# Altium schematic sheet 02-ESP32.SchDoc: *ESP32LX6
size A4; SheetNumber: 2; SheetTotal: 3
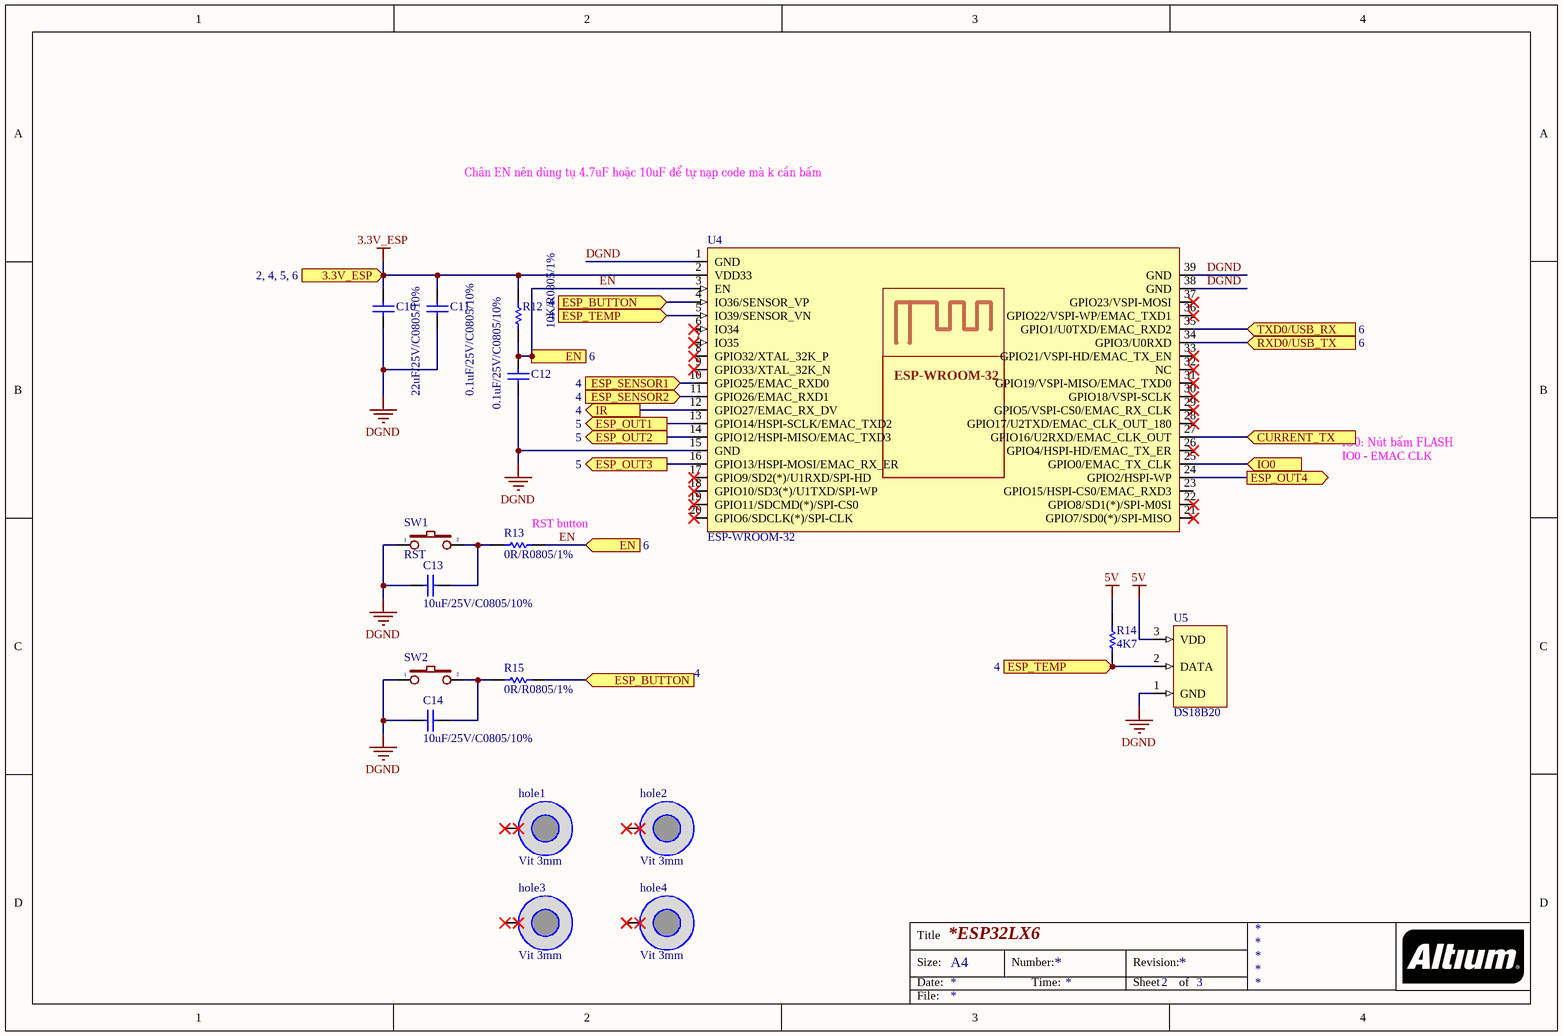
[diagram p0: 02-ESP32.SchDoc]

## Parts
C10  22uF/25V/C0805/10%  [CAP_CERA_C2012(CC0805INCH)]
C11  0.1uF/25V/C0805/10%  [CAP_CERA_C2012(CC0805INCH)]
C12  0.1uF/25V/C0805/10%  [CAP_CERA_C2012(CC0805INCH)]
C13  10uF/25V/C0805/10%  [CAP_CERA_C2012(CC0805INCH)]
C14  10uF/25V/C0805/10%  [CAP_CERA_C2012(CC0805INCH)]
hole1  Vit 3mm  [Screw 3.0]
hole2  Vit 3mm  [Screw 3.0]
hole3  Vit 3mm  [Screw 3.0]
hole4  Vit 3mm  [Screw 3.0]
R12  10K/R0805/1%  [Res 0805 SMD]
R13  0R/R0805/1%  [Res 0805 SMD]
R14  4K7  [Res 0805 SMD]
R15  0R/R0805/1%  [Res 0805 SMD]
SW1  RST  [Button 3x4mm]
SW2  RST  [Button 3x4mm]  (value not drawn)
U4  ESP-WROOM-32  [ESP32 WROOM]
U5  DS18B20

## Ports
3.3V_ESP (in, see 2, 4, 5, 6), CURRENT_TX (in), EN (in, see 6), ESP_BUTTON (in, see 4), ESP_OUT1 (out, see 5), ESP_OUT2 (out, see 5), ESP_OUT3 (out, see 5), ESP_OUT4 (out), ESP_SENSOR1 (in, see 4), ESP_SENSOR2 (in, see 4), ESP_TEMP (in, see 4), IO0 (in), IR (out, see 4), RXD0/USB_TX (in, see 6), TXD0/USB_RX (in, see 6)

## Nets
3.3V_ESP: C10.2 C11.2 R12.1 U4.2(VDD33) ; port 3.3V_ESP
5V: R14.2 U5.3(VDD)
DGND: C10.1 C11.1 C12.1 C13.2 C14.2 SW1.1 SW2.1 U4.1(GND) U4.15(GND) U4.38(GND) U4.39(GND) U5.1(GND)
CURRENT_TX: U4.27(GPIO16/U2RXD/EMAC_CLK_OUT) ; port CURRENT_TX
EN: C12.2 R12.2 R13.2 U4.3(EN) ; port EN
ESP_BUTTON: R15.2 U4.4(IO36/SENSOR_VP) ; port ESP_BUTTON
ESP_OUT1: U4.13(GPIO14/HSPI-SCLK/EMAC_TXD2) ; port ESP_OUT1
ESP_OUT2: U4.14(GPIO12/HSPI-MISO/EMAC_TXD3) ; port ESP_OUT2
ESP_OUT3: U4.16(GPIO13/HSPI-MOSI/EMAC_RX_ER) ; port ESP_OUT3
ESP_OUT4: U4.24(GPIO2/HSPI-WP) ; port ESP_OUT4
ESP_SENSOR1: U4.10(GPIO25/EMAC_RXD0) ; port ESP_SENSOR1
ESP_SENSOR2: U4.11(GPIO26/EMAC_RXD1) ; port ESP_SENSOR2
ESP_TEMP: R14.1 U4.5(IO39/SENSOR_VN) U5.2(DATA) ; port ESP_TEMP
IO0: U4.25(GPIO0/EMAC_TX_CLK) ; port IO0
IR: U4.12(GPIO27/EMAC_RX_DV) ; port IR
RXD0/USB_TX: U4.34(GPIO3/U0RXD) ; port RXD0/USB_TX
TXD0/USB_RX: U4.35(GPIO1/U0TXD/EMAC_RXD2) ; port TXD0/USB_RX
NetC13_1: C13.1 R13.1 SW1.2
NetC14_1: C14.1 R15.1 SW2.2

Not connected (* = marked no-connect by the designer): hole1 1(hole)*; hole2 1(hole)*; hole3 1(hole)*; hole4 1(hole)*; U4 6(IO34)* 7(IO35)* 8(GPIO32/XTAL_32K_P)* 9(GPIO33/XTAL_32K_N)* 17(GPIO9/SD2(*)/U1RXD/SPI-HD)* 18(GPIO10/SD3(*)/U1TXD/SPI-WP)* 19(GPIO11/SDCMD(*)/SPI-CS0)* 20(GPIO6/SDCLK(*)/SPI-CLK)* 21(GPIO7/SD0(*)/SPI-MISO)* 22(GPIO8/SD1(*)/SPI-M0SI)* 23(GPIO15/HSPI-CS0/EMAC_RXD3) 26(GPIO4/HSPI-HD/EMAC_TX_ER)* 28(GPIO17/U2TXD/EMAC_CLK_OUT_180)* 29(GPIO5/VSPI-CS0/EMAC_RX_CLK)* 30(GPIO18/VSPI-SCLK)* 31(GPIO19/VSPI-MISO/EMAC_TXD0)* 32(NC)* 33(GPIO21/VSPI-HD/EMAC_TX_EN)* 36(GPIO22/VSPI-WP/EMAC_TXD1)* 37(GPIO23/VSPI-MOSI)*

## Notes on the sheet
- Chân EN nên dùng tụ 4.7uF hoặc 10uF để tự nạp code mà k cần bấm
- IO0: Nút bấm FLASH
- IO0 - EMAC CLK
- (near R13) RST button
- Title
- Size:
- Date:
- A4
- Number:
- Time:
- Revision:
- Sheet
- of
- File:

## Library data of the parts
C10 = 0.1uF/50V/C0603/10%: 22µF ±20% 25V Ceramic Capacitor X5R 0805 (2012 Metric); Manufacturer: Tariff Applied; ComponentLink1URL: http://www.murata.com/~/media/webrenewal/support/library/catalog/products/capacitor/mlcc/c02e.ashx; ComponentLink1Description: http://www.murata.com/~/media/webrenewal/support/library/catalog/products/capacitor/mlcc/c02e.ashx; Digikey: 1276-2908-1-ND
C11-C14 = 0.1uF/50V/C0603/10%: 0.1µF ±10% 25V Ceramic Capacitor X7R 0805 (2012 Metric); ComponentLink1URL: http://www.murata.com/~/media/webrenewal/support/library/catalog/products/capacitor/mlcc/c02e.ashx; ComponentLink1Description: http://www.murata.com/~/media/webrenewal/support/library/catalog/products/capacitor/mlcc/c02e.ashx; Digikey: 478-3755-1-ND
R12 = 200K/R0603/1%: 10 kOhms ±1% 0.125W, 1/8W Chip Resistor 0805 (2012 Metric) Thick Film; Power (Watts): 0.1W, 1/10W; RoHS: RoHS Compliant; Category: Resistors; Part Status: Active; Features: Moisture Resistant; Operating Temperature: -55°C ~ 155°C; Package / Case: 0603 (1608 Metric); Supplier Device Package: 0603; Size / Dimension: 0.063" L x 0.031" W (1.60mm x 0.80mm); Height - Seated (Max): 0.022" (0.55mm); Failure Rate: -; ComponentLink1URL: http://www.yageo.com/documents/recent/PYu-RC_Group_51_RoHS_L_7.pdf; ComponentLink1Description: http://www.yageo.com/documents/recent/PYu-RC_Group_51_RoHS_L_7.pdf; Digikey: A126332CT-ND
R13 R15 = 200K/R0603/1%: 0 Ohms Jumper 0.125W, 1/8W Chip Resistor 0805 (2012 Metric) Automotive AEC-Q200 Thick Film; Part Status: Active; Height - Seated (Max): 0.022" (0.55mm); Failure Rate: -; ComponentLink1URL: http://www.yageo.com/documents/recent/PYu-RC_Group_51_RoHS_L_7.pdf; ComponentLink1Description: http://www.yageo.com/documents/recent/PYu-RC_Group_51_RoHS_L_7.pdf; Digikey: 541-0.0ACT-ND
R14 = 200K/R0603/1%: 4k7 Ohms Jumper 0.125W, 1/8W Chip Resistor 0805 (2012 Metric); Part Status: Active; Height - Seated (Max): 0.022" (0.55mm); Failure Rate: -; ComponentLink1URL: http://www.yageo.com/documents/recent/PYu-RC_Group_51_RoHS_L_7.pdf; ComponentLink1Description: http://www.yageo.com/documents/recent/PYu-RC_Group_51_RoHS_L_7.pdf; Digikey: 541-0.0ACT-ND
SW1 SW2 = SW2: SWITCH TACTILE SPST-NO 0.05A 12V; Digikey: CKN10384CT-ND
U4 = ESP-WROOM-32: ESP-WROOM-32 (8MB), WIFI MODULE 64 MBITS SPI FLASH; Digikey: 1904-1019-1-ND